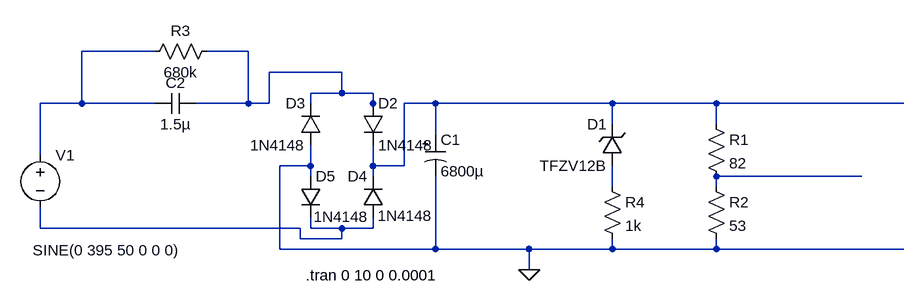
[diagram p0: schematic Final_PSUu.asc]
Final_PSUu.asc, the LTspice schematic file:
Version 4
SHEET 1 1616 680
WIRE -256 -32 -368 -32
WIRE -112 -32 -176 -32
WIRE 32 0 -80 0
WIRE 32 32 32 0
WIRE 32 32 -16 32
WIRE 80 32 32 32
WIRE -368 48 -368 -32
WIRE -368 48 -432 48
WIRE -256 48 -368 48
WIRE -112 48 -112 -32
WIRE -112 48 -192 48
WIRE -80 48 -80 0
WIRE -80 48 -112 48
WIRE -16 48 -16 32
WIRE 80 48 80 32
WIRE 176 48 128 48
WIRE 448 48 176 48
WIRE 608 48 448 48
WIRE 896 48 608 48
WIRE 80 64 80 48
WIRE 448 80 448 48
WIRE 608 80 608 48
WIRE 176 96 176 48
WIRE -432 128 -432 48
WIRE -16 144 -16 112
WIRE -16 144 -64 144
WIRE 80 144 80 112
WIRE 128 144 128 48
WIRE 128 144 80 144
WIRE -16 160 -16 144
WIRE 80 160 80 144
WIRE 832 160 608 160
WIRE 448 176 448 144
WIRE 608 176 608 160
WIRE -432 240 -432 208
WIRE -32 240 -432 240
WIRE -16 240 -16 224
WIRE 32 240 -16 240
WIRE 80 240 80 224
WIRE 80 240 32 240
WIRE -32 256 -32 240
WIRE 32 256 32 240
WIRE 32 256 -32 256
WIRE -64 272 -64 144
WIRE 176 272 176 160
WIRE 176 272 -64 272
WIRE 320 272 176 272
WIRE 448 272 448 256
WIRE 448 272 320 272
WIRE 608 272 608 256
WIRE 608 272 448 272
WIRE 896 272 608 272
WIRE 320 304 320 272
FLAG 320 304 0
SYMBOL voltage -432 112 R0
WINDOW 123 0 0 Left 0
WINDOW 39 0 0 Left 0
WINDOW 3 -12 162 Left 2
SYMATTR Value SINE(0 395 50 0 0 0)
SYMATTR InstName V1
SYMBOL zener 464 144 R180
WINDOW 0 24 64 Left 2
WINDOW 3 24 0 Left 2
SYMATTR InstName D1
SYMATTR Value TFZV12B
SYMBOL res -160 -48 R90
WINDOW 0 0 56 VBottom 2
WINDOW 3 32 56 VTop 2
SYMATTR InstName R3
SYMATTR Value 680k
SYMBOL polcap 160 96 R0
SYMATTR InstName C1
SYMATTR Value 6800µ
SYMBOL cap -192 32 R90
WINDOW 0 0 32 VBottom 2
WINDOW 3 32 32 VTop 2
SYMATTR InstName C2
SYMATTR Value 1.5µ
SYMBOL res 592 64 R0
SYMATTR InstName R1
SYMATTR Value 82
SYMBOL res 592 160 R0
SYMATTR InstName R2
SYMATTR Value 53
SYMBOL diode 64 48 R0
SYMATTR InstName D2
SYMATTR Value 1N4148
SYMBOL diode 0 112 R180
WINDOW 0 24 64 Left 2
WINDOW 3 24 0 Left 2
SYMATTR InstName D3
SYMATTR Value 1N4148
SYMBOL diode 96 224 R180
WINDOW 0 24 64 Left 2
WINDOW 3 -76 3 Left 2
SYMATTR InstName D4
SYMATTR Value 1N4148
SYMBOL diode -32 160 R0
WINDOW 3 21 62 Left 2
SYMATTR Value 1N4148
SYMATTR InstName D5
SYMBOL res 432 160 R0
SYMATTR InstName R4
SYMATTR Value 1k
TEXT -24 312 Left 2 !.tran 0 10 0 0.0001

The netlist it stands for:
* Final_PSUu.asc
V1 N001 N006 SINE(0 395 50 0 0 0)
D1 N005 N003 TFZV12B
R3 N002 N001 680k
C1 N003 0 6800µ
C2 N002 N001 1.5µ
R1 N003 N004 82
R2 N004 0 53
D2 N002 N003 1N4148
D3 0 N002 1N4148
D4 N006 N003 1N4148
D5 0 N006 1N4148
R4 N005 0 1k
.model D D
.lib standard.dio
.tran 0 10 0 0.0001
.backanno
.end